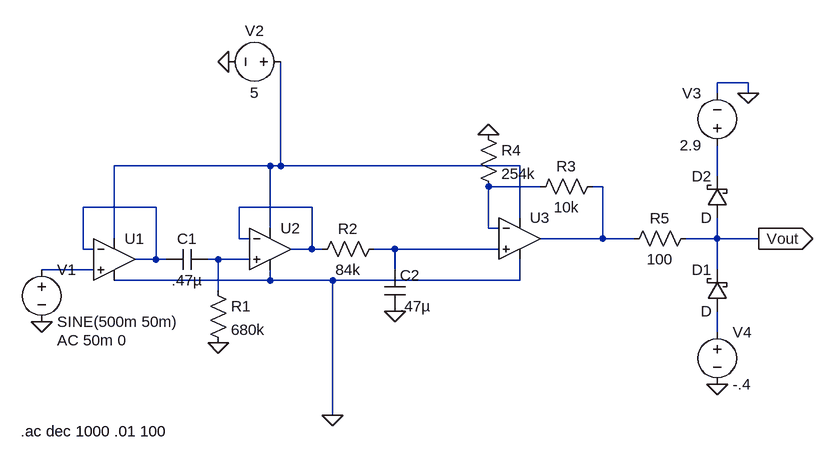
[diagram p0: schematic filter.asc]
filter.asc, the LTspice schematic file:
Version 4
SHEET 1 996 680
WIRE 880 -208 832 -208
WIRE 832 -192 832 -208
WIRE 880 -192 880 -208
WIRE 144 -80 -96 -80
WIRE 160 -80 160 -240
WIRE 160 -80 144 -80
WIRE 528 -80 160 -80
WIRE 832 -64 832 -112
WIRE 560 -48 480 -48
WIRE 656 -48 640 -48
WIRE -32 -16 -144 -16
WIRE 208 -16 96 -16
WIRE 528 0 528 -80
WIRE 144 16 144 -80
WIRE 480 16 480 -48
WIRE 496 16 480 16
WIRE -96 32 -96 -80
WIRE 96 32 96 -16
WIRE 112 32 96 32
WIRE 656 32 656 -48
WIRE 656 32 560 32
WIRE 704 32 656 32
WIRE 832 32 832 0
WIRE 832 32 784 32
WIRE 896 32 832 32
WIRE -144 48 -144 -16
WIRE -128 48 -144 48
WIRE 208 48 208 -16
WIRE 208 48 176 48
WIRE 224 48 208 48
WIRE 336 48 304 48
WIRE 496 48 336 48
WIRE -32 64 -32 -16
WIRE -32 64 -64 64
WIRE -16 64 -32 64
WIRE 64 64 48 64
WIRE 112 64 64 64
WIRE -128 80 -208 80
WIRE 336 80 336 48
WIRE 832 80 832 32
WIRE 144 96 144 80
WIRE 144 96 -96 96
WIRE 240 96 144 96
WIRE 528 96 528 64
WIRE 528 96 240 96
WIRE 64 112 64 64
WIRE 832 176 832 144
WIRE 240 304 240 96
FLAG 336 144 0
FLAG 64 192 0
FLAG -208 160 0
FLAG 240 304 0
FLAG 80 -240 0
FLAG 480 -128 0
FLAG 896 32 Vout
IOPIN 896 32 Out
FLAG 832 256 0
FLAG 880 -192 0
SYMBOL res 48 96 R0
SYMATTR InstName R1
SYMATTR Value 680k
SYMBOL res 320 32 R90
WINDOW 0 0 56 VBottom 2
WINDOW 3 32 56 VTop 2
SYMATTR InstName R2
SYMATTR Value 84k
SYMBOL res 656 -64 R90
WINDOW 0 0 56 VBottom 2
WINDOW 3 32 56 VTop 2
SYMATTR InstName R3
SYMATTR Value 10k
SYMBOL cap 48 48 R90
WINDOW 0 0 32 VBottom 2
WINDOW 3 32 32 VTop 2
SYMATTR InstName C1
SYMATTR Value .47µ
SYMBOL cap 320 80 R0
SYMATTR InstName C2
SYMATTR Value .47µ
SYMBOL UniversalOpamp2 -96 64 R0
SYMATTR InstName U1
SYMBOL voltage -208 64 R0
WINDOW 123 24 124 Left 2
WINDOW 39 0 0 Left 0
SYMATTR Value2 AC 50m 0
SYMATTR InstName V1
SYMATTR Value SINE(500m 50m)
SYMBOL UniversalOpamp2 144 48 R0
SYMATTR InstName U2
SYMBOL UniversalOpamp2 528 32 R0
SYMATTR InstName U3
SYMBOL voltage 176 -240 R90
WINDOW 0 -32 56 VBottom 2
WINDOW 3 32 56 VTop 2
WINDOW 123 0 0 Left 0
WINDOW 39 0 0 Left 0
SYMATTR InstName V2
SYMATTR Value 5
SYMBOL res 464 -144 R0
SYMATTR InstName R4
SYMATTR Value 254k
SYMBOL res 800 16 R90
WINDOW 0 0 56 VBottom 2
WINDOW 3 32 56 VTop 2
SYMATTR InstName R5
SYMATTR Value 100
SYMBOL schottky 848 144 R180
WINDOW 0 24 64 Left 2
WINDOW 3 24 0 Left 2
SYMATTR InstName D1
SYMBOL schottky 848 0 R180
WINDOW 0 24 64 Left 2
WINDOW 3 24 0 Left 2
SYMATTR InstName D2
SYMBOL voltage 832 -96 R180
WINDOW 0 24 96 Left 2
WINDOW 3 24 16 Left 2
SYMATTR InstName V3
SYMATTR Value 2.9
SYMBOL voltage 832 160 R0
SYMATTR InstName V4
SYMATTR Value -.4
TEXT -240 328 Left 2 !.ac dec 1000 .01 100

The netlist it stands for:
* filter.asc
R1 N008 0 680k
R2 N007 N006 84k
R3 N004 N003 10k
C1 N008 N005 .47µ
C2 N007 0 .47µ
XU1 N009 N005 N001 0 N005 level.2 Avol=1Meg GBW=10Meg Slew=10Meg ilimit=25m rail=0 Vos=0 phimargin=45 en=0 enk=0 in=0 ink=0 Rin=500Meg  ; pins IN+ IN- V+ V- OUT
V1 N009 0 SINE(500m 50m) AC 50m 0
XU2 N008 N006 N001 0 N006 level.2 Avol=1Meg GBW=10Meg Slew=10Meg ilimit=25m rail=0 Vos=0 phimargin=45 en=0 enk=0 in=0 ink=0 Rin=500Meg  ; pins IN+ IN- V+ V- OUT
XU3 N007 N003 N001 0 N004 level.2 Avol=1Meg GBW=10Meg Slew=10Meg ilimit=25m rail=0 Vos=0 phimargin=45 en=0 enk=0 in=0 ink=0 Rin=500Meg  ; pins IN+ IN- V+ V- OUT
V2 N001 0 5
R4 0 N003 254k
R5 Vout N004 100
D1 N010 Vout D
D2 Vout N002 D
V3 N002 0 2.9
V4 N010 0 -.4
.model D D
.lib standard.dio
.ac dec 1000 .01 100
.lib UniversalOpamps2.sub
.backanno
.end